# EAGLE schematic SkyMap (EAGLE 9.5.1)
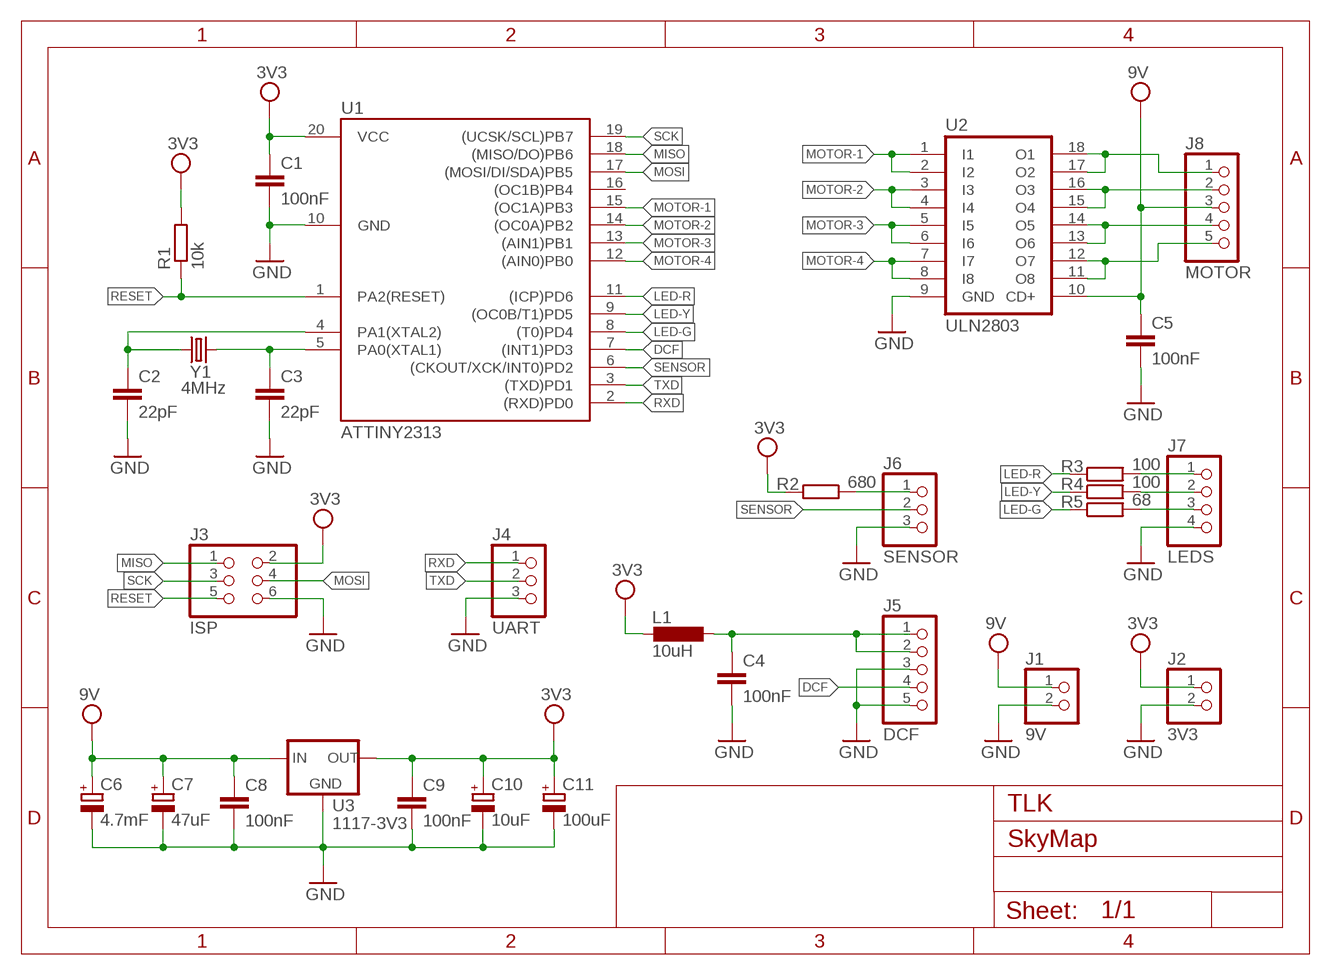
[diagram p0: schematic, sheet 1]

## Parts
C1  100nF  C-EU050-025X075  [C050-025X075]
C2  22pF  C-EU025-025X050  [C025-025X050]
C3  22pF  C-EU025-025X050  [C025-025X050]
C4  100nF  C-EU025-025X050  [C025-025X050]
C5  100nF  C-EU025-025X050  [C025-025X050]
C6  4.7mF  CPOL-EUE5-13  [E5-13]
C7  47uF  CPOL-EUE2.5-6  [E2,5-6]
C8  100nF  C-EU025-025X050  [C025-025X050]
C9  100nF  C-EU025-025X050  [C025-025X050]
C10  10uF  CPOL-EUE2.5-6  [E2,5-6]
C11  100uF  CPOL-EUE3.5-8  [E3,5-8]
J1  9V  PINHD-1X2  [1X02]
J2  3V3  PINHD-1X2  [1X02]
J3  ISP  PINHD-2X3  [2X03]
J4  UART  PINHD-1X3  [1X03]
J5  DCF  PINHD-1X5  [1X05]
J6  SENSOR  PINHD-1X3  [1X03]
J7  LEDS  PINHD-1X4  [1X04]
J8  MOTOR  PINHD-1X5  [1X05]
L1  10uH  L-EU2200-12.7  [2200-12.7]
R1  10k  R-EU_0207/7  [0207/7]
R2  680  R-EU_0207/7  [0207/7]
R3  100  R-EU_0207/7  [0207/7]
R4  100  R-EU_0207/7  [0207/7]
R5  68  R-EU_0207/7  [0207/7]
U1  ATTINY2313  [DIL20]
U2  ULN2803  ULN2803A  [DIL18]
U3  1117-3V3  LP2950ACZ-3.3  [TO92]
Y1  4MHz  CRYSTALHC49S  [HC49/S]

## Nets
DCF: J5.4 U1.7((INT1)PD3)
GND: C1.2 C2.2 C3.2 C4.2 C5.2 C6.- C7.- C8.2 C9.2 C10.- C11.- J1.2 J2.2 J3.6 J4.3 J5.3 J5.5 J6.3 J7.4 U1.10(GND) U2.9(GND) U3.2(GND)
LED-G: R5.1 U1.8((T0)PD4)
LED-R: R3.1 U1.11((ICP)PD6)
LED-Y: R4.1 U1.9((OC0B/T1)PD5)
MISO: J3.1 U1.18((MISO/DO)PB6)
MOSI: J3.4 U1.17((MOSI/DI/SDA)PB5)
MOTOR-1: U1.15((OC1A)PB3) U2.1(I1) U2.2(I2)
MOTOR-2: U1.14((OC0A)PB2) U2.3(I3) U2.4(I4)
MOTOR-3: U1.13((AIN1)PB1) U2.5(I5) U2.6(I6)
MOTOR-4: U1.12((AIN0)PB0) U2.7(I7) U2.8(I8)
N$1: C3.1 U1.5(PA0(XTAL1)) Y1.2
N$2: C2.1 U1.4(PA1(XTAL2)) Y1.1
N$3: J6.1 R2.1
N$4: J7.1 R3.2
N$5: J7.2 R4.2
N$6: J8.1 U2.17(O2) U2.18(O1)
N$7: J8.2 U2.15(O4) U2.16(O3)
N$8: J7.3 R5.2
N$10: J8.4 U2.13(O6) U2.14(O5)
N$11: J8.5 U2.11(O8) U2.12(O7)
N$13: C4.1 J5.1 J5.2 L1.1
RESET: J3.5 R1.1 U1.1(PA2(RESET))
RXD: J4.1 U1.2((RXD)PD0)
SCK: J3.3 U1.19((UCSK/SCL)PB7)
SENSOR: J6.2 U1.6((CKOUT/XCK/INT0)PD2)
TXD: J4.2 U1.3((TXD)PD1)
VCC: C1.1 C9.1 C10.+ C11.+ J2.1 J3.2 L1.2 R1.2 R2.2 U1.20(VCC) U3.1(OUT) ; supply symbol labelled 3V3
VDD: C5.1 C6.+ C7.+ C8.1 J1.1 J8.3 U2.10(CD+) U3.3(IN) ; supply symbol labelled 9V
Unconnected: U1.16((OC1B)PB4)

## Notes on the sheet
- TLK

## Library data of the parts
C1-C5 C8 C9 = rcl:C-EU: CAPACITOR, European symbol; SPICEPREFIX: C
C6 C7 C10 C11 = rcl:CPOL-EU: POLARIZED CAPACITOR, European symbol; SPICEPREFIX: C
J1 J2 = pinhead:PINHD-1X2: PIN HEADER
J3 = pinhead:PINHD-2X3: PIN HEADER
J4 J6 = pinhead:PINHD-1X3: PIN HEADER
J5 J8 = pinhead:PINHD-1X5: PIN HEADER
J7 = pinhead:PINHD-1X4: PIN HEADER
L1 = rcl:L-EU: INDUCTOR, European symbol; SPICEPREFIX: L
R1-R5 = rcl:R-EU_: RESISTOR, European symbol; SPICEPREFIX: R
U1 = .MW:ATTINY2313: MICROCONTROLLER 2 Kbytes FLASH 128 bytes SRAM 128 bytes EEPROM UART
U2 = uln-udn:ULN2803A: DRIVER ARRAY
U3 = v-reg:LP2950?*: Source: http://cache.national.com/ds/LP/LP2950.pdf
Y1 = crystal:CRYSTAL: CRYSTAL; OC_FARNELL: 1667008; OC_NEWARK: unknown